# Altium project Kursach001.PrjPcb
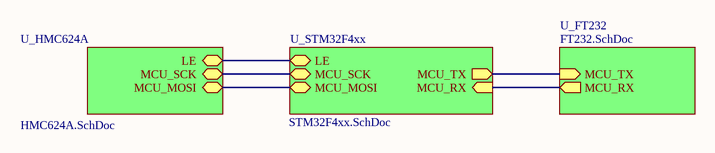
[diagram p0: Overview.SchDoc]
4 sheets, 48 parts. Net scope: hierarchical (ports join the sheet entries above them; power ports are global).
Board file: Kursach001PCB.~(701).PcbDoc
Sheets:
  Overview.SchDoc
    U_HMC624A = HMC624A.SchDoc
    U_STM32F4xx = STM32F4xx.SchDoc
    U_FT232 = FT232.SchDoc

## Sheet Overview.SchDoc
size A4; SheetNumber: 1; SheetTotal: 4

### Sub-sheets
U_FT232 = FT232.SchDoc: MCU_TX (in), MCU_RX (out)
U_HMC624A = HMC624A.SchDoc: LE (bidir), MCU_SCK (bidir), MCU_MOSI (bidir)
U_STM32F4xx = STM32F4xx.SchDoc: MCU_TX (out), MCU_RX (in), MCU_MOSI (bidir), MCU_SCK (bidir), LE (bidir)

### Nets
LE: sheet U_HMC624A/LE, sheet U_STM32F4xx/LE
MCU_MOSI: sheet U_HMC624A/MCU_MOSI, sheet U_STM32F4xx/MCU_MOSI
MCU_RX: sheet U_STM32F4xx/MCU_RX, sheet U_FT232/MCU_RX
MCU_SCK: sheet U_HMC624A/MCU_SCK, sheet U_STM32F4xx/MCU_SCK
MCU_TX: sheet U_STM32F4xx/MCU_TX, sheet U_FT232/MCU_TX

## Sheet HMC624A.SchDoc
size A4; SheetNumber: 2; SheetTotal: 5
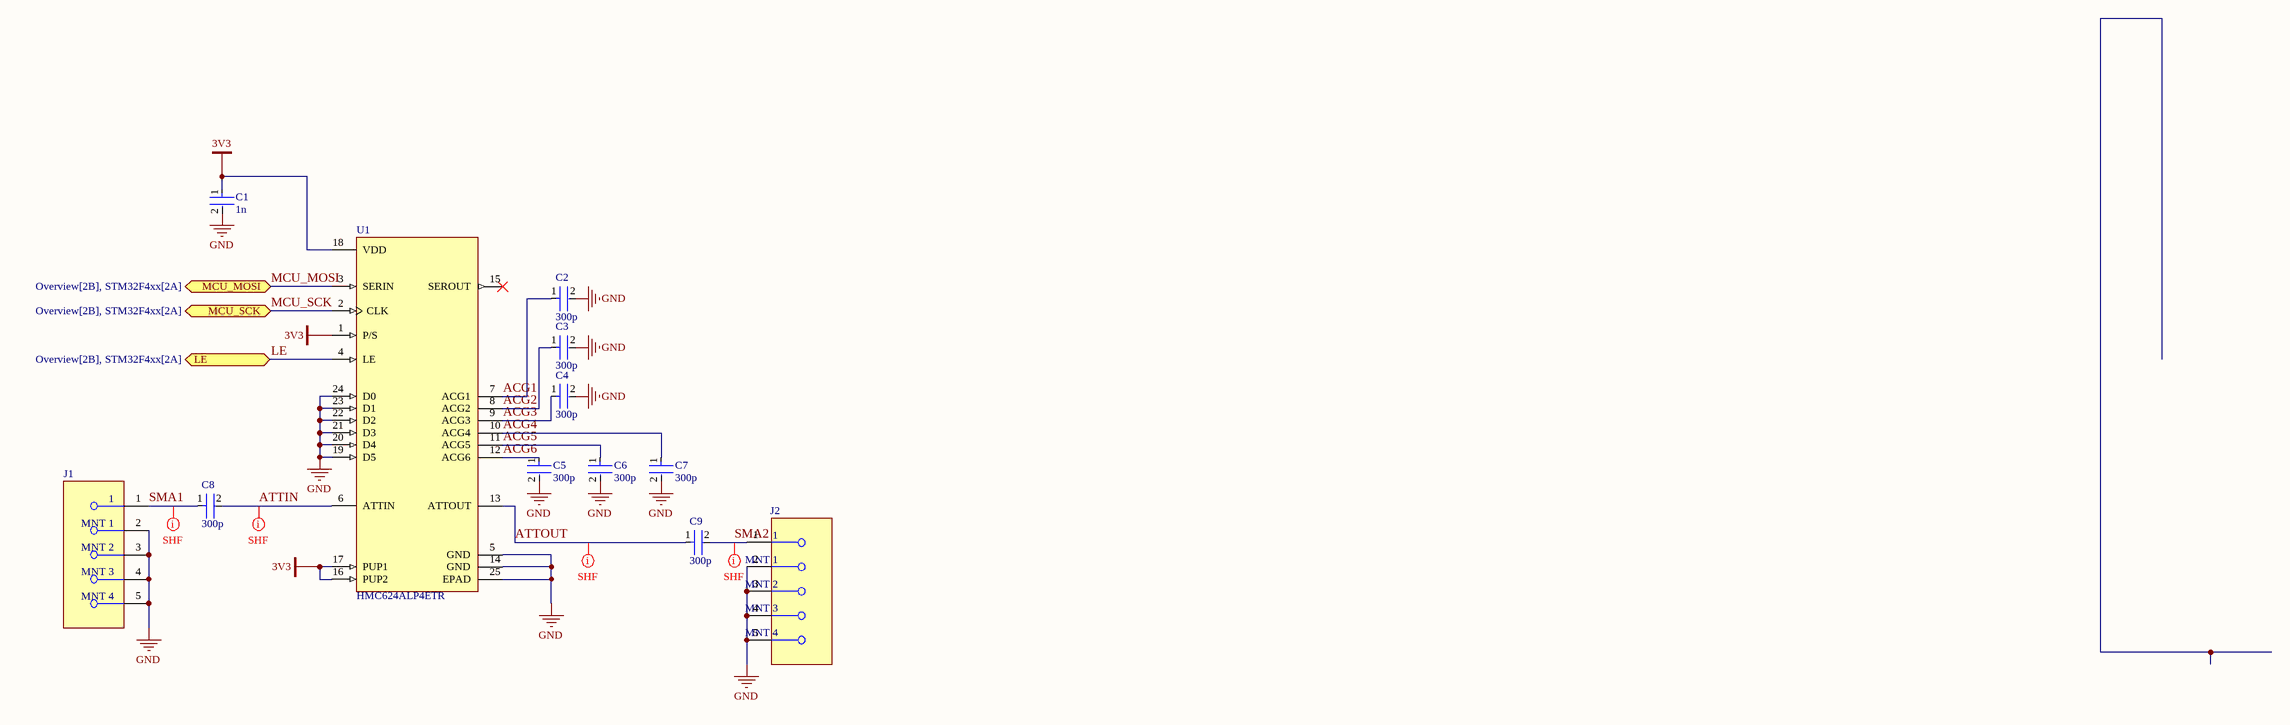
[diagram p1: HMC624A.SchDoc]

### Parts
C1  1n  [FP-C0402-BB-MFG]
C2  300p  [FP-CC0402-MFG]
C3  300p  [FP-CC0402-MFG]
C4  300p  [FP-CC0402-MFG]
C5  300p  [FP-CC0402-MFG]
C6  300p  [FP-CC0402-MFG]
C7  300p  [FP-CC0402-MFG]
C8  300p  [FP-CC0402-MFG]
C9  300p  [FP-CC0402-MFG]
J1  CON-SMA-EDGE-S  [FP-CON-SMA-EDGE-S-MFG]  (value not drawn)
J2  CON-SMA-EDGE-S  [FP-CON-SMA-EDGE-S-MFG]  (value not drawn)
U1  HMC624ALP4ETR  [FP-CP-24-16-IPC_C]

### Ports
LE (bidir, see Overview[2B], STM32F4xx[2A]), MCU_MOSI (bidir, see Overview[2B], STM32F4xx[2A]), MCU_SCK (bidir, see Overview[2B], STM32F4xx[2A])

### Nets
3V3: C1.1 U1.1(P/S) U1.16(PUP2) U1.17(PUP1) U1.18(VDD)
GND: C1.2 C2.2 C3.2 C4.2 C5.2 C6.2 C7.2 J1.2(MNT_1) J1.3(MNT_2) J1.4(MNT_3) J1.5(MNT_4) J2.2(MNT_1) J2.3(MNT_2) J2.4(MNT_3) J2.5(MNT_4) U1.5(GND) U1.14(GND) U1.19(D5) U1.20(D4) U1.21(D3) U1.22(D2) U1.23(D1) U1.24(D0) U1.25(EPAD)
ACG1: C2.1 U1.7(ACG1)
ACG2: C3.1 U1.8(ACG2)
ACG3: C4.1 U1.9(ACG3)
ACG4: C7.1 U1.10(ACG4)
ACG5: C6.1 U1.11(ACG5)
ACG6: C5.1 U1.12(ACG6)
ATTIN: C8.2 U1.6(ATTIN)
ATTOUT: C9.1 U1.13(ATTOUT)
LE: U1.4(LE) ; port LE
MCU_MOSI: U1.3(SERIN) ; port MCU_MOSI
MCU_SCK: U1.2(CLK) ; port MCU_SCK
SMA1: C8.1 J1.1
SMA2: C9.2 J2.1

Not connected (* = marked no-connect by the designer): U1 15(SEROUT)*

### Layout directives
net class SHF: ATTIN, ATTOUT, SMA1, SMA2

### Library data of the parts
C1 = CMP-2008-02329-2: Cap Ceramic 0.001uF 50V X7R 10% Pad SMD 0402 125C Automotive T/R; Manufacturer: Kemet; Manufacturer Part Number: C0402C102K5RACAUTO; Capacitance: 1,000 pF; Temperature Coefficient: 15%; Value: 1,000 pF; Tolerance: 0.1; Device Class L1: Passive Components; Lead Free: Yes; Device Class L2: Capacitors; Category: Cap; Temperature: -55°C to +125°C; Automotive: No; Temperature Range High: +125°C; Ipc Land Pattern Name: CAPC10050X50; Height: 0.55mm; Package: C0402-BB; Digikey Description: Cap Ceramic 0.001uF 50V X7R 10% Pad SMD 0402 125C Automotive T/R; Octopart: https://octopart.com/c0402c102k5racauto-kemet-34852013; Material: Ceramic; Voltage Rating: 50 V; Temperature Range Low: -55°C; ComponentLink2URL: https://content.kemet.com/datasheets/KEM_C1002_X7R_SMD.pdf; Device Class L3: Ceramic Capacitors; Temperature Characteristic: X7R; RoHS: TRUE; ComponentLink2Description: Datasheet
C2-C9 = CMP-03422-000106-1: CC0402 330 pF X7R 10.00% 25 V; Manufacturer Part Number: CC0402KRX7R8BB331; Manufacturer: YAGEO; Temperature Coefficient: 30ppm/°C; Material: Ceramic; Tolerance: 0.1; Capacitance: 330 pF; Value: 330 pF; Automotive Grade: NA; Voltage Rating: 25 V; Automotive: No; Device Class L2: Capacitors; Temperature: -55°C to +125°C; Height: 0.55mm; Category: Cap; Ipc Land Pattern Name: CAPC10050X50; ComponentLink2Description: Datasheet; ComponentLink2URL: http://www.yageo.com/documents/recent/UPY-GP_NP0_16V-to-50V_16.pdf; Device Class L1: Passive Components; Temperature Characteristic: X7R; Octopart: https://octopart.com/cc0402krx7r8bb331-yageo-80896401; Package: CC0402; Device Class L3: Ceramic Capacitors; Temperature Range Low: -55°C; Temperature Range High: +125°C; RoHS: TRUE; Lead Free: Yes; Footprint Url: http://www.yageo.com/exep/pages/download/literatures/UPY-C_GEN_24.pdf
J1 J2 = CMP-204357-000001-1: CONN SMA JACK STR EDGE MNT; Manufacturer: RF Solutions Ltd.; Impedance: 50Ω; Conn Orientation: Right Angle; Is Female: yes; Number Of Contacts: 1; Frequency: 18GHz; Shielding: true; Category: Conn; ComponentLink2URL: https://www.rfsolutions.co.uk/downloads/1498648656DS-CON-EDGE-SMA-4.pdf; Octopart: https://octopart.com/con-sma-edge-s-rf+solutions-70967450; Package: CONN_JACK; Manufacturer Part Number: CON-SMA-EDGE-S; Height: 6.35mm; Device Class L1: Connectors; Footprint Url: https://forum.upverter.com/uploads/default/original/3X/b/e/be75b907af57498775929d6d9099689c472e0307.pdf; Contact Material: Gold; ComponentLink2Description: Datasheet; Device Class L2: RF / Coaxial Connectors; RoHS: TRUE; Device Class L3: unset; Digikey Description: CONN SMA JACK STR EDGE MNT; Lead Free: Yes; Automotive: No
U1 = CMP-09141-000007-1: RF ATTENUATOR 31.5DB 50OHM 24QFN; Manufacturer: Analog Devices; Max Junction Temp: +150°C; Bandwidth: 5.9GHz; Standoff Height: 0.02mm; Max Frequency: 6GHz; Automotive: No; Device Class L3: unset; Digikey Description: RF ATTENUATOR 31.5DB 50OHM 24QFN; Category: IC; Temperature Range High: +85°C; Package: CP-24-16; Device Class L2: RF Semiconductors and Devices; ComponentLink2Description: Datasheet; Temperature: -40°C to +85°C; Octopart: https://octopart.com/hmc624alp4etr-analog+devices-51967055; ComponentLink2URL: https://www.analog.com/media/en/technical-documentation/data-sheets/hmc624a.pdf; Height: 0.9mm; Manufacturer Part Number: HMC624ALP4ETR; Mouser Description: 6Bits 0.5dBStep 31.5dB Digital Attenuator 6GHz 24-Pin QFN EP T/R; Device Class L1: Integrated Circuits (ICs); RoHS: TRUE; Footprint Url: https://www.analog.com/media/en/package-pcb-resources/package/pkg_pdf/lfcspcp/cp-24/cp_24_16.pdf; Ipc Land Pattern Name: QFN50P400X400X85-24; Lead Free: Yes; Temperature Range Low: -40°C

## Sheet STM32F4xx.SchDoc
size A4; SheetNumber: 3; SheetTotal: 5
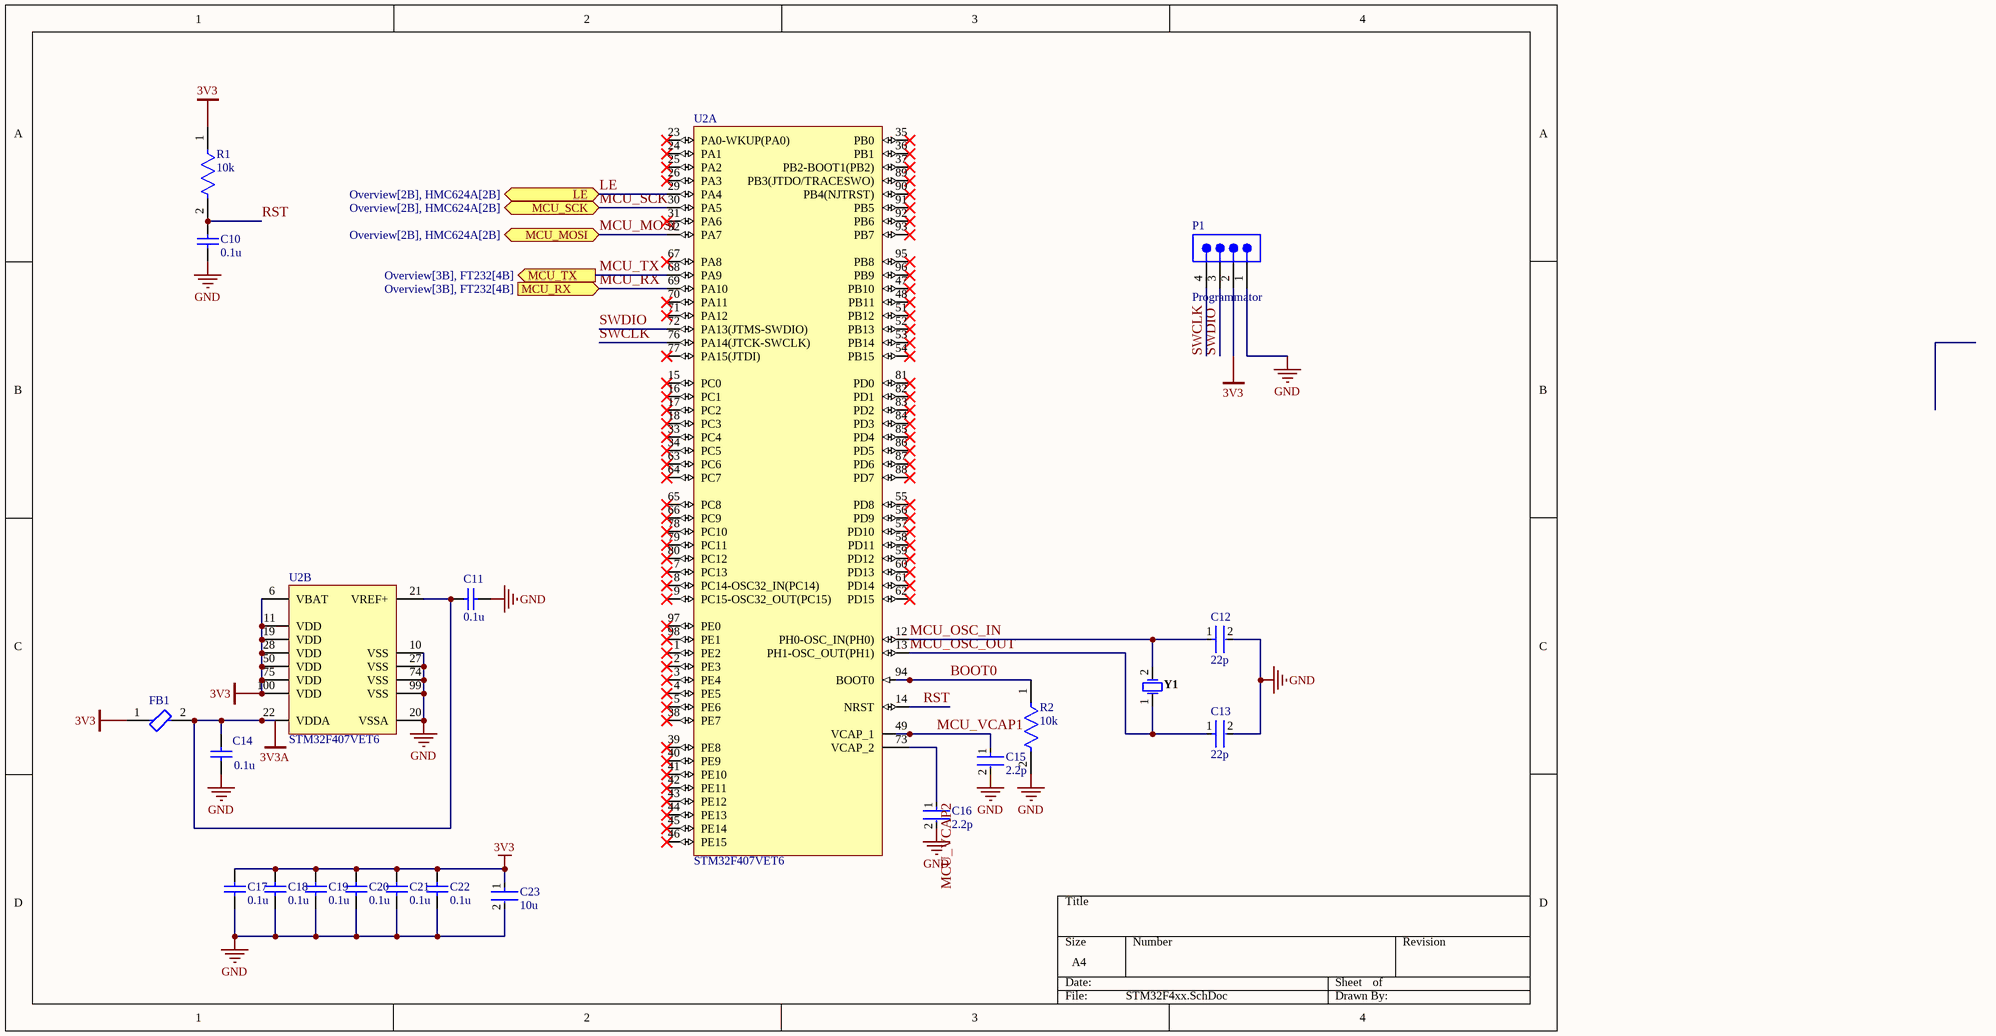
[diagram p2: STM32F4xx.SchDoc]

### Parts
C10  0.1u  [CAPC1608X92X38NL15T08]
C11  0.1u  [CAPC1608X92X38NL15T08]
C12  22p  [FP-C0603C-CF-MFG]
C13  22p  [FP-C0603C-CF-MFG]
C14  0.1u  [CAPC1608X92X38NL15T08]
C15  2.2p  [FP-CC0603-DA-MFG]
C16  2.2p  [FP-CC0603-DA-MFG]
C17  0.1u  [CAPC1608X92X38NL15T08]
C18  0.1u  [CAPC1608X92X38NL15T08]
C19  0.1u  [CAPC1608X92X38NL15T08]
C20  0.1u  [CAPC1608X92X38NL15T08]
C21  0.1u  [CAPC1608X92X38NL15T08]
C22  0.1u  [CAPC1608X92X38NL15T08]
C23  10u  [FP-GRM21B-0_2-e0_2_0_7-MFG]
FB1  BLM21PG600BH1D  [FP-BLM21-0_2-t0_85-e0_5-IPC_C]  (value not drawn)
P1  Programmator  [SMTC-TSW-104-08-X-S]
R1  10k  [FP-AC0603-IPC_A]
R2  10k  [FP-AC0603-IPC_A]
U2  STM32F407VET6  [STM-LQFP100_M]  (parts A,B of 2)
Y1  NX3225GD-8MHZ-STD-CRA-3  [NDK-NX3225GD-8MHZ-STD-CRA-3_V]  (value not drawn)

### Ports
LE (bidir, see Overview[2B], HMC624A[2B]), MCU_MOSI (bidir, see Overview[2B], HMC624A[2B]), MCU_RX (in, see Overview[3B], FT232[4B]), MCU_SCK (bidir, see Overview[2B], HMC624A[2B]), MCU_TX (out, see Overview[3B], FT232[4B])

### Nets
3V3: C17.2 C18.2 C19.2 C20.2 C21.2 C22.2 C23.1 FB1.1 P1.2 R1.1 U2.6(VBAT) U2.11(VDD) U2.19(VDD) U2.28(VDD) U2.50(VDD) U2.75(VDD) U2.100(VDD)
3V3A: C11.2 C14.2 FB1.2 U2.21(VREF+) U2.22(VDDA)
GND: C10.1 C11.1 C12.2 C13.2 C14.1 C15.2 C16.2 C17.1 C18.1 C19.1 C20.1 C21.1 C22.1 C23.2 P1.1 R2.2 U2.10(VSS) U2.20(VSSA) U2.27(VSS) U2.74(VSS) U2.99(VSS)
BOOT0: R2.1 U2.94(BOOT0)
LE: U2.29(PA4) ; port LE
MCU_MOSI: U2.32(PA7) ; port MCU_MOSI
MCU_OSC_IN: C12.1 U2.12(PH0-OSC_IN(PH0)) Y1.2
MCU_OSC_OUT: C13.1 U2.13(PH1-OSC_OUT(PH1)) Y1.1
MCU_RX: U2.69(PA10) ; port MCU_RX
MCU_SCK: U2.30(PA5) ; port MCU_SCK
MCU_TX: U2.68(PA9) ; port MCU_TX
MCU_VCAP1: C15.1 U2.49(VCAP_1)
MCU_VCAP2: C16.1 U2.73(VCAP_2)
RST: C10.2 R1.2 U2.14(NRST)
SWCLK: P1.4 U2.76(PA14(JTCK-SWCLK))
SWDIO: P1.3 U2.72(PA13(JTMS-SWDIO))

Not connected (* = marked no-connect by the designer): U2 1(PE2)* 2(PE3)* 3(PE4)* 4(PE5)* 5(PE6)* 7(PC13)* 8(PC14-OSC32_IN(PC14))* 9(PC15-OSC32_OUT(PC15))* 15(PC0)* 16(PC1)* 17(PC2)* 18(PC3)* 23(PA0-WKUP(PA0))* 24(PA1)* 25(PA2)* 26(PA3)* 31(PA6)* 33(PC4)* 34(PC5)* 35(PB0)* 36(PB1)* 37(PB2-BOOT1(PB2))* 38(PE7)* 39(PE8)* 40(PE9)* 41(PE10)* 42(PE11)* 43(PE12)* 44(PE13)* 45(PE14)* 46(PE15)* 47(PB10)* 48(PB11)* 51(PB12)* 52(PB13)* 53(PB14)* 54(PB15)* 55(PD8)* 56(PD9)* 57(PD10)* 58(PD11)* 59(PD12)* 60(PD13)* 61(PD14)* 62(PD15)* 63(PC6)* 64(PC7)* 65(PC8)* 66(PC9)* 67(PA8)* 70(PA11)* 71(PA12)* 77(PA15(JTDI))* 78(PC10)* 79(PC11)* 80(PC12)* 81(PD0)* 82(PD1)* 83(PD2)* 84(PD3)* 85(PD4)* 86(PD5)* 87(PD6)* 88(PD7)* 89(PB3(JTDO/TRACESWO))* 90(PB4(NJTRST))* 91(PB5)* 92(PB6)* 93(PB7)* 95(PB8)* 96(PB9)* 97(PE0)* 98(PE1)*

### Library data of the parts
C10 C11 C14 C17-C22 = CMP-2006-01166-1: Manufacturer: Vitramon; Part Number: VJ0603Y104KXXAP
C12 C13 = CMP-03020-026609-1: C0603 22 pF X7R 30ppm/°C 10.00% 100 V; Manufacturer Part Number: C0603C220K1RACAUTO; Manufacturer: KEMET; Voltage Rating: 100 V; Value: 22 pF; Tolerance: 0.1; Material: Ceramic; Automotive Grade: Grade 1; Device Class L3: Ceramic Capacitors; Temperature Range High: +125°C; Height: 0.87mm; Temperature Coefficient: 30ppm/°C; Automotive: Yes; Octopart: https://octopart.com/c0603c220k1racauto-kemet-91893838; Device Class L2: Capacitors; RoHS: TRUE; Lead Free: Yes; Category: Cap; Capacitance: 22 pF; ComponentLink2Description: Datasheet; Package: C0603C-CF; Device Class L1: Passive Components; Temperature: -55°C to +125°C; Temperature Characteristic: X7R; ComponentLink2URL: https://api.kemet.com/component-edge/download/datasheet/C0603C100J5GACAUTO.pdf; Temperature Range Low: -55°C
C15 C16 = CMP-03422-000630-1: CC0603 2.2 uF X7R 10.00% 10 V; Manufacturer Part Number: CC0603KPX7R6BB225; Manufacturer: YAGEO; Value: 2.2 uF; Tolerance: 0.1; Voltage Rating: 10 V; Temperature Coefficient: 15%; Material: Ceramic; Automotive: No; ComponentLink2URL: http://www.yageo.com/documents/recent/UPY-GPHC_X7R_6.3V-to-50V_18.pdf; Temperature Range Low: -55°C; Package: CC0603-DA; Lead Free: Yes; RoHS: TRUE; Height: 0.9mm; Octopart: https://octopart.com/cc0603kpx7r6bb225-yageo-88116733; ComponentLink2Description: Datasheet; Category: Cap; Device Class L1: Passive Components; Temperature: -55°C to +125°C; Footprint Url: http://www.yageo.com/exep/pages/download/literatures/UPY-C_GEN_24.pdf; Voltage: 10 V; Temperature Range High: +125°C; Device Class L3: Ceramic Capacitors; Capacitance: 2.2 uF; Device Class L2: Capacitors; Temperature Characteristic: X7R
C23 = CMP-06035-044754-1: Chip Multilayer Ceramic Capacitors for General Purpose, 0805, 10uF, X5R, 15%, 20%, 50V
FB1 = CMP-06046-002606-1: Chip Ferrite Bead, 0805, 60Ω @ 100MHz, 0.02Ω, 25%, 1.9A; RoHS Compliant: No
P1 = CMP-1024-00357-1: 0.025" SQ Post Header, Through-hole, Vertical, -55 to 125 degC, 2.54 mm Pitch, 4-Pin, Male, RoHS; Manufacturer: Samtec; PartNumber: TSW-104-08-G-S; Pitch: 2.54 mm; RoHS: True; ComponentLink3URL: http://www.samtec.com/documents/webfiles/cpdf/TSW-XXX-XX-XXX-X-XX-XXX-MKT.pdf; Mounting Technology: Through-hole; ComponentLink2URL: http://www.samtec.com/documents/webfiles/pdf/TSW_TH.PDF; ComponentLink1URL: http://www.samtec.com; ComponentLink3Description: Package Specification; PackageVersion: DM, 8/1988; ComponentLink2Description: Datasheet; PackageReference: TSW-104-08-X-S; PackageDescription: .025[0.64] SQ. Post Terminal Strip Assembly; ComponentLink1Description: Manufacturer URL; Temperature Range: -55 to 125 degC; DatasheetVersion: F-214; Orientation: Vertical
R1 R2 = CMP-03412-040683-1: RES 10kΩ 5.00% 0.2W 0603
U2 = CMP-0243-00016-3: ARM Cortex-M4 32-bit MCU+FPU, 210 DMIPS, 512 kB Flash, 192 kB Internal RAM, 82 I/Os, 100-pin LQFP, -40 to 85 degC, Tray; Manufacturer: STMicroelectronics; Supply Voltage(Vcc) max (V): 3.6; Supply Voltage(Vcc) min (V): 1.8; I/Os (High Current): 82; FLASH Size (Prog) (kB): 512; Operating Frequency(F) (Processor speed) (MHz): 168; D/A Converter: 2x12-bit; Internal RAM Size (kB): 192; PackageReference: LQFP100; Core: ARM Cortex-M4; ComponentLink1URL: http://www.st.com/web/en/home.html; ComponentLink1Description: Manufacturer URL; DatasheetVersion: Rev. 4; Packing: Tray; Mounting Technology: Surface Mount; ComponentLink2Description: Datasheet; ComponentLink2URL: http://www.st.com/st-web-ui/static/active/en/resource/technical/document/datasheet/DM00037051.pdf; ComponentLink3Description: Package Specification; PartNumber: STM32F407VET6; PackageVersion: Rev. 1, 06/2013; PackageDescription: 100-Pin Low Profile Quad Flat Package, 14 x 14 mm Body, 0.5 mm Pitch; ComponentLink3URL: http://www.st.com/st-web-ui/static/active/en/resource/technical/document/data_brief/DM00071938.pdf
Y1 = CMP-2000-07595-1: Crystal Unit, 8 MHz, 8 pF, -40 to 150 degC, 2-Pin SMD, RoHS, Tape and Reel; Manufacturer: NDK; Load Capacitance: 8pF; ESR (Equivalent Series Resistance): 500Ohm; Frequency Tolerance: 50ppm; Frequency Stability: 150ppm; Frequency: 8MHz; Case/Package: SMD/SMT; Datasheet Version: 11/2016; Min Operating Temperature: -40degC; Packaging: TapeandReel; Width: 0.098inch; Package Quantity: 3000; Number of Pins: 2; Package Description: 2-Pin Surface Mount Device, Body 3.2 x 2.5 mm; RoHSCompliant: True; Package Reference: NX3225GD-8MHZ-STD-CRA-3; Datasheet URL: http://www.ndk.com/images/products/catalog/c_NX3225GD-STD-CRA-3_e.pdf; Mounting Technology: SurfaceMount; Length: 0.126inch; Mount: SurfaceMount; Manufacturer URL: http://www.ndk.com/en/; Max Operating Temperature: 150degC; Height: 0.039inch

## Sheet FT232.SchDoc
size A4; SheetNumber: 4; SheetTotal: 5
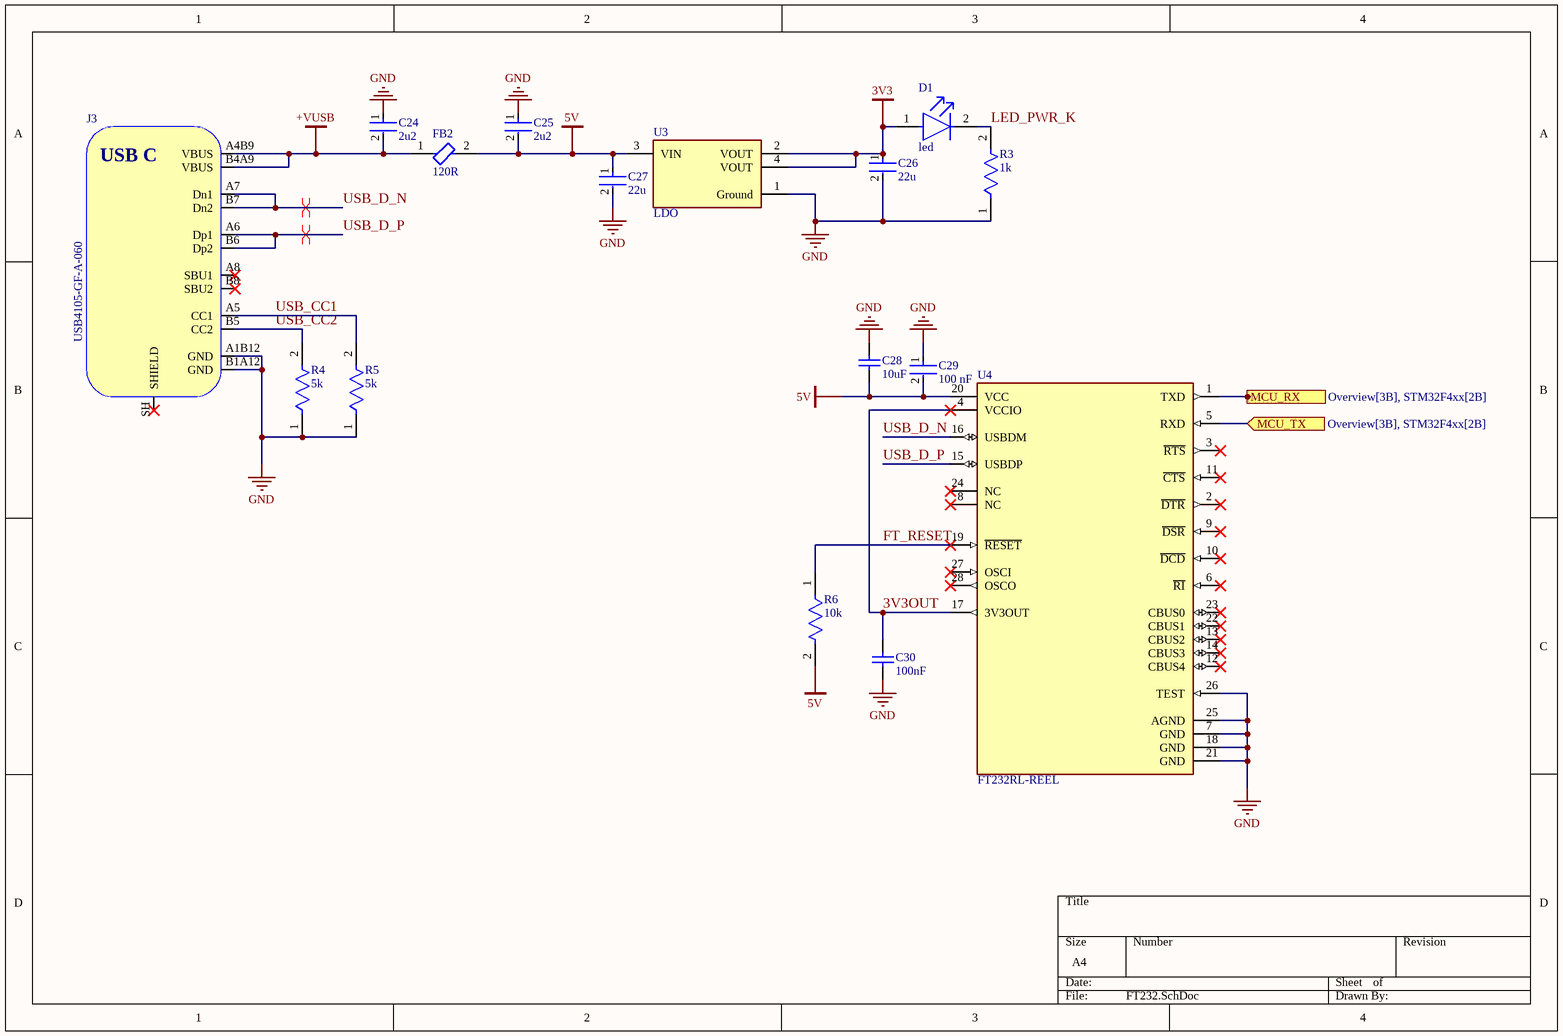
[diagram p3: FT232.SchDoc]

### Parts
C24  2u2  [FP-CC0603-DA-MFG]
C25  2u2  [FP-CC0603-DA-MFG]
C26  22u  [FP-GRM21B-0_2-e0_2_0_7-IPC_C]
C27  22u  [FP-GRM21B-0_2-e0_2_0_7-IPC_C]
C28  10uF  [CAPC0603(1608)100_M]
C29  100 nF  [FP-C0402-BB-MFG]
C30  100nF  [CAPC2013X145X50ML20T25]
D1  led  [FP-SM0402GC-MFG]
FB2  120R  [FP-BLM21-0_2-t0_85-e0_5-IPC_C]
J3  USB4105-GF-A-060  [USB4105-GF-A-060]
R3  1k  [FP-MCS0402-IPC_C]
R4  5k  [FP-TFCR0603-IPC_A]
R5  5k  [FP-TFCR0603-IPC_A]
R6  10k  [FP-AC0603-IPC_A]
U3  LDO  [FP-AMS1117-IPC_C]
U4  FT232RL-REEL  [FP-SSOP-28-MFG]

### Ports
MCU_RX (out, see Overview[3B], STM32F4xx[2B]), MCU_TX (in, see Overview[3B], STM32F4xx[2B])

### Nets
3V3: C26.1 D1.1(A) U3.2(VOUT) U3.4(VOUT)
5V: C25.2 C27.1 C28.1 C29.2 FB2.2 R6.2 U3.3(VIN) U4.20(VCC)
+VUSB: C24.2 FB2.1 J3.A4B9(VBUS) J3.B4A9(VBUS)
GND: C24.1 C25.1 C26.2 C27.2 C28.2 C29.1 C30.1 J3.A1B12(GND) J3.B1A12(GND) R3.1 R4.1 R5.1 U3.1(Ground) U4.7(GND) U4.18(GND) U4.21(GND) U4.25(AGND) U4.26(TEST)
3V3OUT: C30.2 U4.4(VCCIO) U4.17(3V3OUT)
FT_RESET: R6.1 U4.19(~{RESET})
LED_PWR_K: D1.2(C) R3.2
MCU_RX: U4.1(TXD) ; port MCU_RX
MCU_TX: U4.5(RXD) ; port MCU_TX
USB_CC1: J3.A5(CC1) R5.2
USB_CC2: J3.B5(CC2) R4.2
USB_D_N: J3.A7(Dn1) J3.B7(Dn2) U4.16(USBDM)
USB_D_P: J3.A6(Dp1) J3.B6(Dp2) U4.15(USBDP)

Not connected (* = marked no-connect by the designer): J3 A8(SBU1)* B8(SBU2)* SH(SHIELD)*; U4 2(~{DTR})* 3(~{RTS})* 6(~{RI})* 8(NC)* 9(~{DSR})* 10(~{DCD})* 11(~{CTS})* 12(CBUS4)* 13(CBUS2)* 14(CBUS3)* 22(CBUS1)* 23(CBUS0)* 24(NC)* 27(OSCI)* 28(OSCO)*

### Layout directives
differential pair; differential pair class DIFF_USB: USB_D_N, USB_D_P

### Notes on the sheet
- (in symbol USB4105-GF-A-060) USB C

### Library data of the parts
C24 C25 = CMP-03422-000257-1: CAP CER 2.2UF 16V X5R 0603; Manufacturer Part Number: CC0603MRX5R7BB225; Manufacturer: YAGEO; Tolerance: 0.2; Temperature Coefficient: 15%; Material: Ceramic; Mouser Description: Multilayer Ceramic Capacitors MLCC - SMD/SMT 2.2uF 16V 20% Ceramic Capacitor; Temperature Range Low: -55°C; Lead Free: Yes; Device Class L1: Passive Components; Device Class L2: Capacitors; Temperature Characteristic: X5R; Height: 0.9mm; Digikey Description: CAP CER 2.2UF 16V X5R 0603; Package: CC0603-DA; RoHS: TRUE; Capacitance: 2.2 uF; Automotive: No; Value: 2.2 uF; Device Class L3: Ceramic Capacitors; Voltage: 16 V; ComponentLink2URL: http://www.yageo.com/documents/recent/UPY-GPHC_X7R_6.3V-to-50V_18.pdf; Footprint Url: http://www.yageo.com/exep/pages/download/literatures/UPY-C_GEN_24.pdf; Octopart: https://octopart.com/cc0603mrx5r7bb225-yageo-81932636; Temperature Range High: +125°C; Temperature: -55°C to +125°C; Category: Cap; Voltage Rating: 16 V; ComponentLink2Description: Datasheet
C26 C27 = CMP-06035-025383-1: Chip Multilayer Ceramic Capacitors for General Purpose, 0805, 22uF, X5R, 15%, 20%, 16V; Weight: 0.000335oz; Case/Package: 0805; Dielectric: X5R; Min Operating Temperature: -55°C; Tolerance: 20%; Packaging: Tape and Reel; Package Quantity: 10000; Mount: Surface Mount; Thickness: 0.057inch; Capacitance: 22uF; Length: 0.079inch; Max Operating Temperature: 85°C; Voltage Rating: 16V; Width: 0.049inch; Voltage Rating (DC): 16V
C28 = CMP-1035-02796-1: CAP 10uF 6.3V ±10% 0603 (1608 Metric) Thickness 1mm SMD; Case-EIA: 0603; Tolerance: Â±10%; Case-Metric: 1608; Value: 10uF; Technology: SMT; Rated Voltage: 6.3 V; Max Thickness: 1 mm
C29 = CMP-03020-014070-2: CAP CER 0.1UF 25V X5R 0402; Manufacturer: Kemet; Manufacturer Part Number: C0402C104M3PAC7867; Material: Ceramic; Tolerance: 0.2; Value: 0.10 μF; Temperature Coefficient: 15%; Height: 0.55mm; Category: Cap; Temperature: -55°C to +125°C; Automotive: No; Package: C0402-BB; Temperature Range Low: -55°C; ComponentLink2Description: Datasheet; Device Class L3: Ceramic Capacitors; ComponentLink2URL: https://content.kemet.com/datasheets/KEM_C1002_X7R_SMD.pdf; Octopart: https://octopart.com/c0402c104m3pac7867-kemet-84304880; Temperature Characteristic: X5R; RoHS: TRUE; Temperature Range High: +125°C; Device Class L1: Passive Components; Capacitance: 0.10 μF; Lead Free: Yes; Voltage Rating: 25 V; Ipc Land Pattern Name: CAPC10050X50; Device Class L2: Capacitors; Digikey Description: CAP CER 0.1UF 25V X5R 0402
C30 = CMP-1036-04420-2: Manufacturer: Kemet; Part Number: C0805C104K5RACTM
D1 = CMP-35283-000001-2: LED GREEN CLEAR 0402 SMD; Lens Size: 1mm; Luminous Intensity: 28.5mcd; Viewing Angle: 130°; Forward Voltage: 1.9V; Test Current: 20mA; Lens Color: Colorless; Lens Style: Flat; Dominant Wavelength: 572nm; Case Code (Metric): 1005; Mount: Surface Mount; Case Code (Imperial): 0402; Length: 1mm; Width: 0.5mm; Case/Package: 0402; Lens Transparency: Clear; Height: 0.71mm; Packaging: Tape and Reel; Color: Green
FB2 = CMP-06046-002606-1: as FB1 on sheet STM32F4xx; RoHS Compliant: No
J3 = USB4105-GF-A-060: USB Connector Type C SMT 12 Pin; Manufacturer: GCT; Manufacturer Part Number: USB4105-GF-A-060; Distributor Link: https://eu.mouser.com/ProductDetail/GCT/USB4105-GF-A-060?qs=QNEnbhJQKvY2mocwNJzgfA%3D%3D
R3 = CMP-2002-02445-2: RES SMD 1.2K OHM 1% 1/10W 0402; Resistance: 1kR; Tolerance: 0.1%; Max Power Dissipation: 63mW; Temperature Coefficient: 25ppm/°C; Max Operating Temperature: 125°C; Min Operating Temperature: -55°C; Case/Package: 0402; Packaging: Tape and Reel; Width: 0.02inch; Lead Free: Lead Free; Number of Terminations: 2; Height: 0.015inch; Package Quantity: 10000; Length: 0.039inch; Composition: Thin Film; Contact Plating: Tin; Depth: 0.5mm; Military Standard: Not
R4 R5 = CMP-250906-062905-1: RES Thin Film,  4kΩ, 0.1%, 0.1W, 25ppm/°C, 0603
R6 = CMP-03412-040683-1: RES 10kΩ 5.00% 0.2W 0603
U3 = CMP-209535-000001-1: LDO Voltage Regulators 1A, 3.3V; Manufacturer Part Number: AMS1117-3.3; Manufacturer: Advanced Monolithic Systems; Dropout Voltage: 1.1V; Output Type: Fixed; Nominal Supply Current: 5mA; Max Power Dissipation: 1.2W; Max Supply Voltage: 15V; Number Of Outputs: 1; Standoff Height: 0.64mm; Max Junction Temp: +125°C; Height: 1.8mm; Package: AMS1117; Device Class L2: Power Management ICs; ComponentLink2Description: Datasheet; ComponentLink2URL: http://www.advanced-monolithic.com/pdf/ds1117.pdf; Category: IC; RoHS: TRUE; Automotive: No; Device Class L1: Integrated Circuits (ICs); Output Current: 1A; Device Class L3: Voltage Regulators - Linear; Temperature: -40°C to +125°C; Output Voltage: 3.3V; Temperature Range Low: -40°C; Octopart: https://octopart.com/ams1117-3.3-advanced+monolithic+systems-25899300; Lead Free: Yes; Ipc Land Pattern Name: SOT229P700X180-4; Temperature Range High: +125°C
U4 = CMP-0078-00029-4: IC USB FS SERIAL UART 28-SSOP; Data Rate: 12Mbps; Max Supply Voltage: 5.25V; Operating Supply Current: 15mA; Number of Channels: 1; Voltage: 5V; Min Supply Voltage: 3.3V; Radiation Hardening: No; Mount: Surface Mount; Min Operating Temperature: -40°C; Package Quantity: 2000; Number of Transceivers: 1; Width: 5.3mm; Number of Pins: 28; Height: 1.75mm; Weight: 0.080001oz; Lead Free: Lead Free; Length: 10.2mm; REACH SVHC: No SVHC; Max Operating Temperature: 85°C; Packaging: Tape and Reel; Interface: UART; Case/Package: SSOP

## Nets that join several sheets
3V3: HMC624A (5 pins), STM32F4xx (17 pins), FT232 (C26.1 D1.1 U3.2 U3.4)
GND: HMC624A (24 pins), STM32F4xx (21 pins), FT232 (18 pins)
LE: HMC624A (U1.4), STM32F4xx (U2.29)
MCU_MOSI: HMC624A (U1.3), STM32F4xx (U2.32)
MCU_RX: STM32F4xx (U2.69), FT232 (U4.1)
MCU_SCK: HMC624A (U1.2), STM32F4xx (U2.30)
MCU_TX: STM32F4xx (U2.68), FT232 (U4.5)